# Altium schematic sheet External_connector_Power.SchDoc
size A2; DocumentNumber: 4; SheetNumber: 4; SheetTotal: 10
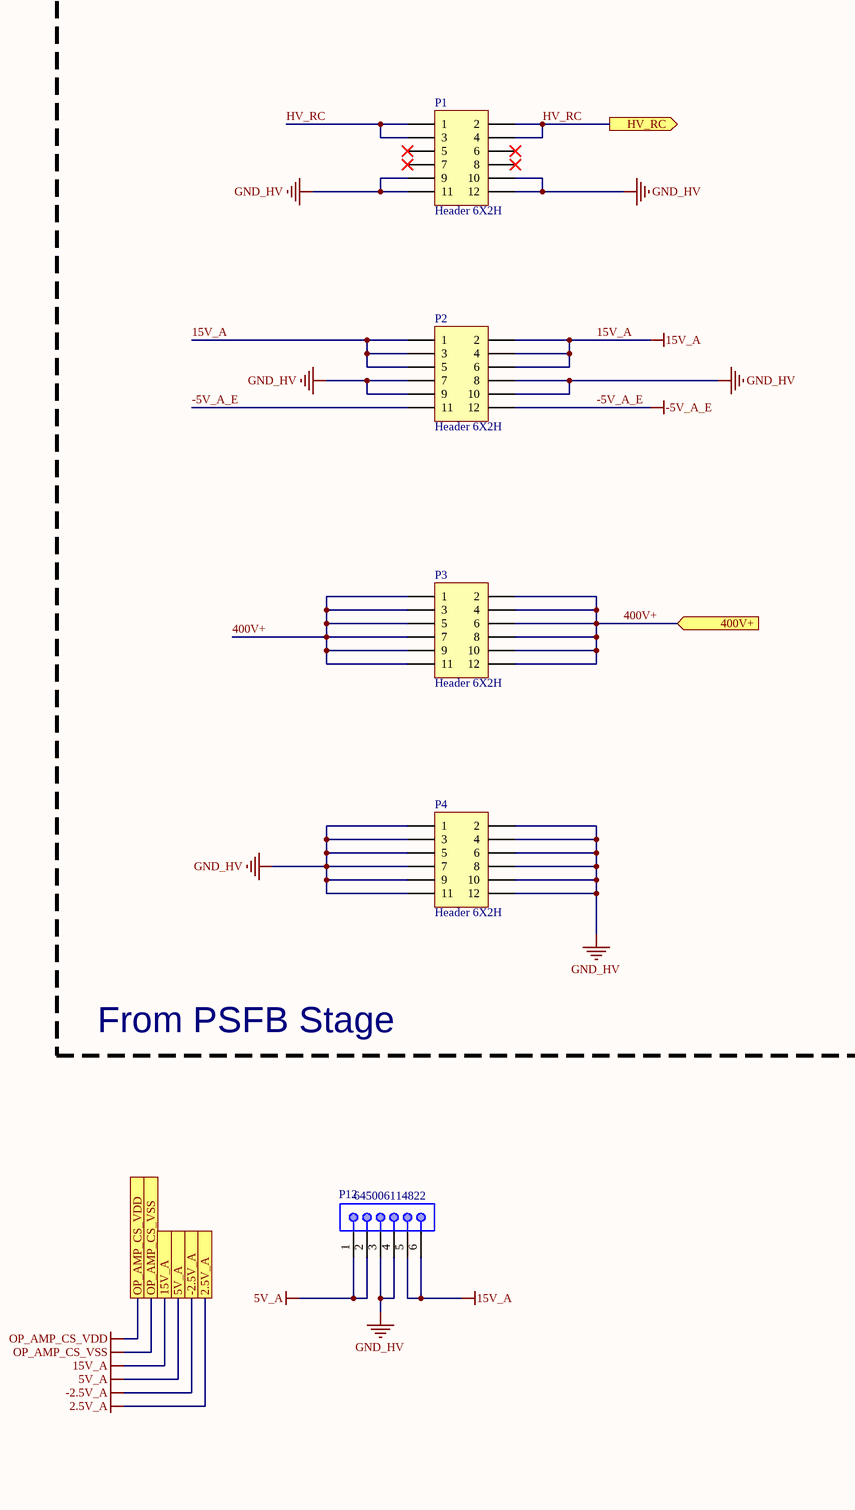
[diagram p0: External_connector_Power.SchDoc, left]
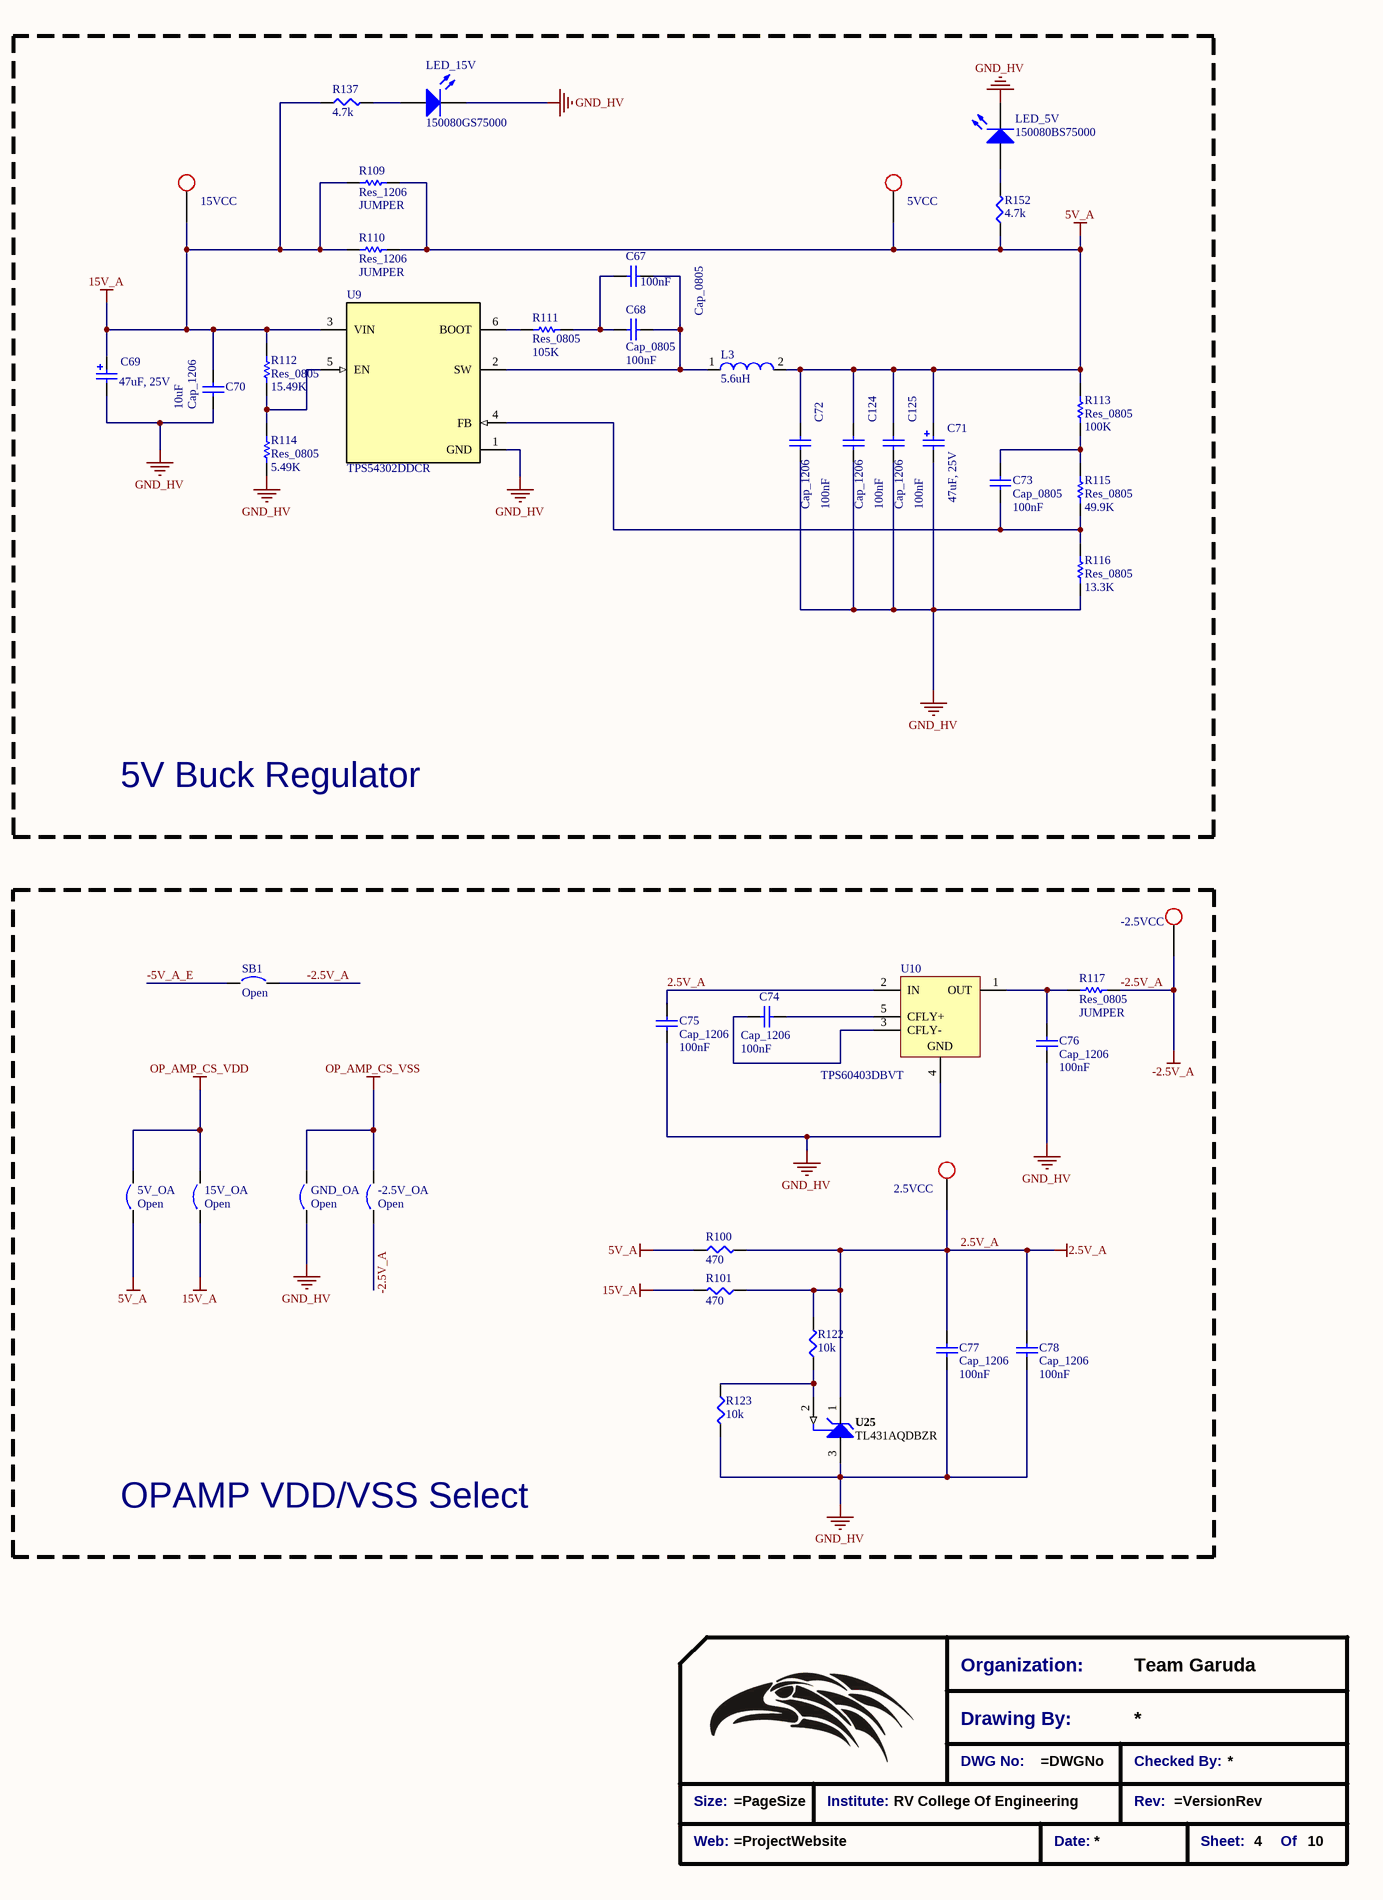
[diagram p1: External_connector_Power.SchDoc, right]

## Parts
2.5VCC  Test Point  [Test_point_SMD]  (value not drawn)  (no BOM)
5V_OA  Open  [Solder Bridge - HP]  (no BOM)
5VCC  Test Point  [Test_point_SMD]  (value not drawn)  (no BOM)
15V_OA  Open  [Solder Bridge - HP]  (no BOM)
15VCC  Test Point  [Test_point_SMD]  (value not drawn)  (no BOM)
*?  Title_Block  (value not drawn)  (graphical)
-2.5V_OA  Open  [Solder Bridge - HP]  (no BOM)
-2.5VCC  Test Point  [Test_point_SMD]  (value not drawn)  (no BOM)
C67  Cap_0805  Size: 100nF  [SMD-0805C]
C68  Cap_0805  Size: 100nF  [SMD-0805C]
C69  47uF, 25V  [WCAP-ASLL_6.3x5.5]
C70  Cap_1206  value 10uF  [SMD-1206C]
C71  47uF, 25V  [WCAP-ASLL_6.3x5.5]
C72  Cap_1206  value 100nF  [SMD-1206C]
C73  Cap_0805  Size: 100nF  [SMD-0805C]
C74  Cap_1206  value 100nF  [SMD-1206C]
C75  Cap_1206  value 100nF  [SMD-1206C]
C76  Cap_1206  value 100nF  [SMD-1206C]
C77  Cap_1206  value 100nF  [SMD-1206C]
C78  Cap_1206  value 100nF  [SMD-1206C]
C124  Cap_1206  value 100nF  [SMD-1206C]
C125  Cap_1206  value 100nF  [SMD-1206C]
GND_OA  Open  [Solder Bridge - HP]  (no BOM)
L3  5.6uH  [WE-PD-L]
LED_5V  150080BS75000  [0805_A]
LED_15V  150080GS75000  [0805_A]
P1  Header 6X2H  [Stackable-20mm]
P2  Header 6X2H  [Stackable-20mm]
P3  Header 6X2H  [Stackable-20mm]
P4  Header 6X2H  [Stackable-20mm]
P12  645006114822  [645006114822]
R100  470  [SMD-1206-RES]
R101  470  [SMD-1206-RES]
R109  Res_1206  value JUMPER  [WRIS-KSKE_1206_H=0.6mm]
R110  Res_1206  value JUMPER  [WRIS-KSKE_1206_H=0.6mm]
R111  Res_0805  value 105K  [WRIS-KSKE_0805_H=0.6mm]
R112  Res_0805  value 15.49K  [WRIS-KSKE_0805_H=0.6mm]
R113  Res_0805  value 100K  [WRIS-KSKE_0805_H=0.6mm]
R114  Res_0805  value 5.49K  [WRIS-KSKE_0805_H=0.6mm]
R115  Res_0805  value 49.9K  [WRIS-KSKE_0805_H=0.6mm]
R116  Res_0805  value 13.3K  [WRIS-KSKE_0805_H=0.6mm]
R117  Res_0805  value JUMPER  [WRIS-KSKE_0805_H=0.6mm]
R122  10k  [SMD-1206-RES]
R123  10k  [SMD-1206-RES]
R137  4.7k  [SMD-0805-RES]
R152  4.7k  [SMD-0805-RES]
SB1  Open  [Solder Bridge - HP - SQ]  (no BOM)
U9  TPS54302DDCR  [SOT95P278X110-6N]
U10  TPS60403DBVT  [DBV0005A_M]
U25  TL431AQDBZR  [DBZ0003A_M]

## Blocks framed on the sheet
From PSFB Stage: P1-P4
5V Buck Regulator: 5VCC 15VCC C67-C73 C124 C125 L3 LED_5V LED_15V R109-R116 R137 R152 U9
OPAMP VDD/VSS Select: 2.5VCC 5V_OA 15V_OA -2.5V_OA -2.5VCC C74-C78 GND_OA R100 R101 R117 R122 R123 SB1 U10 U25

## Ports
2.5V_A, 5V_A, 15V_A, 400V+ (in), -2.5V_A, HV_RC (out), OP_AMP_CS_VDD, OP_AMP_CS_VSS

## Nets
2.5V_A: 2.5VCC.1 C75.2 C77.2 C78.2 R100.2 R101.1 R122.2 U10.2(IN) U25.1(CATHODE) ; port 2.5V_A
5V_A: 5V_OA.1 5VCC.1 C71.2(P) C72.1 C124.1 C125.1 L3.2 P12.1 P12.2 R100.1 R109.2 R110.2 R113.2 R152.1 ; port 5V_A
15V_A: 15V_OA.1 15VCC.1 C69.2(P) C70.1 P2.1 P2.2 P2.3 P2.4 P2.5 P2.6 P12.5 P12.6 R101.2 R109.1 R110.1 R112.2 R137.1 U9.3(VIN) ; port 15V_A
-2.5V_A: -2.5V_OA.1 -2.5VCC.1 R117.2 SB1.2 ; port -2.5V_A
-5V_A_E: P2.11 P2.12 SB1.1
GND_HV: C69.1(N) C70.2 C71.1(N) C72.2 C75.1 C76.1 C77.1 C78.1 C124.2 C125.2 GND_OA.1 LED_5V.1(K) LED_15V.1(K) P1.9 P1.10 P1.11 P1.12 P2.7 P2.8 P2.9 P2.10 P4.1 P4.2 P4.3 P4.4 P4.5 P4.6 P4.7 P4.8 P4.9 P4.10 P4.11 P4.12 P12.3 P12.4 R114.1 R116.1 R123.2 U9.1(GND) U10.4(GND) U25.3(ANODE)
OP_AMP_CS_VDD: 5V_OA.2 15V_OA.2 ; port OP_AMP_CS_VDD
OP_AMP_CS_VSS: -2.5V_OA.2 GND_OA.2 ; port OP_AMP_CS_VSS
400V+: P3.1 P3.2 P3.3 P3.4 P3.5 P3.6 P3.7 P3.8 P3.9 P3.10 P3.11 P3.12 ; port 400V+
HV_RC: P1.1 P1.2 P1.3 P1.4 ; port HV_RC
NetC67_1: C67.1 C68.1 R111.1
NetC67_2: C67.2 C68.2 L3.1 U9.2(SW)
NetC73_1: C73.1 R115.1 R116.2 U9.4(FB)
NetC73_2: C73.2 R113.1 R115.2
NetC74_1: C74.1 U10.5(CFLY+)
NetC74_2: C74.2 U10.3(CFLY-)
NetC76_2: C76.2 R117.1 U10.1(OUT)
NetLED_5V_2: LED_5V.2(A) R152.2
NetLED_15V_2: LED_15V.2(A) R137.2
NetR111_2: R111.2 U9.6(BOOT)
NetR112_1: R112.1 R114.2 U9.5(EN)
NetR122_1: R122.1 R123.1 U25.2(REF)

Not connected (* = marked no-connect by the designer): P1 5* 6* 7* 8*

## Notes on the sheet
- (in symbol Title_Block) Organization:; Team Garuda; Drawing By:; DWG No:; Checked By:; Size:; Institute:; RV College Of Engineering; Rev:; Web:; Date:; Sheet:; Of

## Library data of the parts
2.5VCC 5VCC 15VCC -2.5VCC = Test Point: TP
5V_OA 15V_OA -2.5V_OA GND_OA SB1 = Solder Bridge: Circuit Breaker; Published: 24-Mar-1999; Revision: July-2002: Re-released for DXP Platform.; Publisher: Altium Limited
*? = Title_Block: Standard Title Block
C67 C68 C73 = Cap: Capacitor; Value: 100pF; Published: 8-Jun-2000; LatestRevisionDate: 17-Jul-2002; LatestRevisionNote: Re-released for DXP Platform.; PackageReference: RAD-0.3; Publisher: Altium Limited; PackageDescription: Radial Cap, Thru-Hole; 2 Leads; 0.3 in Pin Spacing
C69 C71 = 865060443004: WCAP-ASLL SMT Aluminum Electrolytic Capacitors, D6.3mm x L5.5mm, 47uF, +/-20%, 25VDC; Dissipation Factor: 14%; Endurance: 2000h; Leakage Current: 11.75uA; Ripple Current max.: 230mA; Technical Reference: ASED055470M025DVCTBB000; ComponentLink1Description: Manufacturer; ComponentLink1URL: http://www.we-online.de; ComponentLink2Description: Datasheet; ComponentLink2URL: https://katalog.we-online.com/pbs/datasheet/865060443004.pdf; Length: 5.5mm; Mounting Technology: SMT; Operating Temperature: -55 to +105degC; Packaging: Tape and Reel; Published Date: August 2019; Capacitance: 47uF; Diameter: 6.3mm; Part Number: 865060443004; Publisher: Wurth Elektronik; Capacitance Tolerance: +/-20%; Rated Voltage: 25VDC
C70 C72 C74-C78 C124 C125 = Cap: Capacitor; Published: 8-Jun-2000; LatestRevisionDate: 17-Jul-2002; LatestRevisionNote: Re-released for DXP Platform.; PackageReference: RAD-0.3; Publisher: Altium Limited; PackageDescription: Radial Cap, Thru-Hole; 2 Leads; 0.3 in Pin Spacing
L3 = CMP-0227-00698-1: SMD-Shielded Power Inductor WE-PD, L = 4.70 µH; Inductance: 4.70 ÂµH; ComponentLink1Description: Manufacturer Link; ComponentLink2Description: Datasheet; ComponentLink2URL: http://www.we-online.de/katalog/media/pdf/744771004.pdf; PackageReference: WE-PD-L; ComponentLink1URL: http://www.we-online.com; DatasheetVersion: ver 7, Sep-2006; PackageDescription: SMD Inductor, 2-Leads, Body 12.0 x 12.0 mm; PackageVersion: 2006
LED_5V = 150080BS75000: SMD mono-color Chip LED, WL-SMCW, Blue; PackageReference: 0805_A; Color: Blue; PartNumber: 150080BS75000; ComponentLink1Description: Manufacturer URL; ComponentLink1URL: http://www.we-online.com; ComponentLink2Description: Datasheet; ComponentLink2URL: http://katalog.we-online.com/led/datasheet/150080BS75000.pdf
LED_15V = 150080GS75000: SMD mono-color Chip LED, WL-SMCW, Green; PackageReference: 0805_A; Color: Green; PartNumber: 150080GS75000; ComponentLink1Description: Manufacturer URL; ComponentLink1URL: http://www.we-online.com; ComponentLink2Description: Datasheet; ComponentLink2URL: http://katalog.we-online.com/led/datasheet/150080GS75000.pdf
P1-P4 = Header 6X2H: Header, 6-Pin, Dual row, Right Angle; LatestRevisionDate: 17-Jul-2002; LatestRevisionNote: Re-released for DXP Platform.; Publisher: Altium Limited
P12 = 645006114822: WR-WTB THT Male Vertical Locking Header, pitch 3.96mm, 6p; Pin Number: 6; Contact Resistance: 20mOhm; Rated Current: 7A; Withstanding Voltage: 1500VAC; Working Voltage: 250VAC; ComponentLink1Description: Manufacturer; ComponentLink1URL: http://www.we-online.de; ComponentLink2Description: Datasheet; ComponentLink2URL: https://www.we-online.com/catalog/datasheet/645006114822.pdf; Pitch: 3.96mm; Published Date: January 2020; Publisher: Wurth Elektronik; Mounting Technology: THT; Packaging: Bag; Operating Temperature: -40 to +105degC; Part Number: 645006114822; Gender: Male; Type: Vertical
R100 R101 = ERJ-8ENF4700V: RES SMD 470 OHM 1% 1/4W 1206; Manufacturer: Panasonic Electronic Components; Factory Stock: 0; Unit Price (USD): 0.00933; @ qty: 1500; Minimum Quantity: 1; Power (Watts): 0.25W, 1/4W; Temperature Coefficient: ±100ppm/°C; Part Number: ERJ-8ENF4700V; Datasheets: http://industrial.panasonic.com/www-cgi/jvcr13pz.cgi?E+PZ+3+AOA0002+ERJ8ENF4700V+7+WW; Image: //media.digikey.com/Renders/Panasonic%20Renders/ERJ-1206%20Pkg.jpg; Digi-Key Part Number: P470FCT-ND; Quantity Available: 55045; Packaging: Cut Tape (CT); Series: ERJ; Part Status: Active; Value: 470; Tolerance: ±1%; Composition: Thick Film; Features: Automotive AEC-Q200; Operating Temperature: -55°C ~ 155°C; Package / Case: 1206 (3216 Metric); Supplier Device Package: 1206; Size / Dimension: 0.126" L x 0.063" W (3.20mm x 1.60mm); Height - Seated (Max): 0.028" (0.70mm); Number of Terminations: 2; Failure Rate: -
R109-R117 = Res1: Resistor; Published: 8-Jun-2000; LatestRevisionDate: 17-Jul-2002; LatestRevisionNote: Re-released for DXP Platform.; PackageReference: AXIAL-0.3; Publisher: Altium Limited; PackageDescription: Axial Device, Thru-Hole; 2 Leads; 0.3 in Pin Spacing
R122 R123 = ERJ-8ENF1002V: RES SMD 10K OHM 1% 1/4W 1206; Manufacturer: Panasonic Electronic Components; Factory Stock: 0; Unit Price (USD): 0.00933; @ qty: 1500; Minimum Quantity: 1; Power (Watts): 0.25W, 1/4W; Temperature Coefficient: ±100ppm/°C; Part Number: ERJ-8ENF1002V; Datasheets: http://industrial.panasonic.com/www-cgi/jvcr13pz.cgi?E+PZ+3+AOA0002+ERJ8ENF1002V+7+WW; Image: //media.digikey.com/Renders/Panasonic%20Renders/ERJ-1206%20Pkg.jpg; Digi-Key Part Number: P10.0KFCT-ND; Quantity Available: 1108398; Packaging: Cut Tape (CT); Series: ERJ; Part Status: Active; Value: 10k; Tolerance: ±1%; Composition: Thick Film; Features: Automotive AEC-Q200; Operating Temperature: -55°C ~ 155°C; Package / Case: 1206 (3216 Metric); Supplier Device Package: 1206; Size / Dimension: 0.126" L x 0.063" W (3.20mm x 1.60mm); Height - Seated (Max): 0.028" (0.70mm); Number of Terminations: 2; Failure Rate: -
R137 R152 = ERJ-6ENF4701V: RES SMD 4.7K OHM 1% 1/8W 0805; Manufacturer: Panasonic Electronic Components; Factory Stock: 0; Unit Price (USD): 0.00729; @ qty: 1500; Minimum Quantity: 1; Power (Watts): 0.125W, 1/8W; Temperature Coefficient: ±100ppm/°C; Part Number: ERJ-6ENF4701V; Datasheets: http://industrial.panasonic.com/www-cgi/jvcr13pz.cgi?E+PZ+3+AOA0002+ERJ6ENF4701V+7+WW; Image: //media.digikey.com/Renders/Panasonic%20Renders/ERJ-0805%20Pkg.jpg; Digi-Key Part Number: P4.70KCCT-ND; Quantity Available: 312387; Packaging: Cut Tape (CT); Series: ERJ; Part Status: Active; Value: 4.7k; Tolerance: ±1%; Composition: Thick Film; Features: Automotive AEC-Q200; Operating Temperature: -55°C ~ 155°C; Package / Case: 0805 (2012 Metric); Supplier Device Package: 0805; Size / Dimension: 0.079" L x 0.049" W (2.00mm x 1.25mm); Height - Seated (Max): 0.028" (0.70mm); Number of Terminations: 2; Failure Rate: -
U9 = TPS54302DDCR: Imported; Manufacturer: Texas Instruments; PartNumber: TPS54302DDC; RefDes: RefDes; TYPE: TYPE; Value: Value; Manufacturer_Part_Number: TPS54302DDCR; Manufacturer_Name: Texas Instruments
U10 = CMP-0391-00003-2: -1.8 to -5.25 V, Inverting Charge Pump Regulator, 60 mA, 1.8 to 5.25 V Input with 2-Cell Alkaline / Nixx Input, -40 to 85 degC, 5-pin SOT23 (DBV5), Green (RoHS & no Sb/Br); Manufacturer: Texas Instruments; Topology: Inverting Buck/Boost; Switching Frequency(Max)(kHz): 300; Efficiency(Typ)(%): 99; Iout(Max)(A): 0.06; 2-Cell Alkaline/Nixx Input: TRUE; Iq(Typ)(mA): 0.425; Vin(Min)(V): 1.8; Vin(Max)(V): 5.25; Vout(Max)(V): -5.25; PartNumber: TPS60403DBVT; Eco-Plan: Green (RoHS & no Sb/Br); ComponentLink3URL: http://www.ti.com/litv/pdf/mpds018i; DatasheetVersion: SLVS324A; PackageReference: DBV0005A; ComponentLink2URL: http://www.ti.com/general/docs/lit/getliterature.tsp?genericPartNumber=TPS60403&fileType=pdf; PackageVersion: 4073253-4/K; ComponentLink1URL: http://www.ti.com/; Vout(Min)(V): -1.8; ComponentLink2Description: Datasheet; Mounting Technology: Surface Mount; ComponentLink3Description: Package Specification; ComponentLink1Description: Manufacturer URL; Code_JEDEC: MO-178; PackageDescription: 5-Pin Plastic Small Outline, Body 1.60 Ãƒâ€” 2.90 mm, Pitch 0.95 mm
U25 = CMP-0366-01210-2: Adjustable Precision Shunt Regulator, 34 ppm / degC, 100 mA, -40 to 125 degC, 3-pin SOT-23 (DBZ), Green (RoHS & no Sb/Br); Manufacturer: Texas Instruments; Iout/Iz(Max)(mA): 100; Min Iz for Regulation(uA): 600; SubFamily: Shunt Voltage Reference; Temp Coeff(Typ)(ppm/ degree C): 34; VO Adj(Max)(V): 36; Rating: Catalog; Initial Accuracy @ 25/deg C(%): 1; VO Adj(Min)(V): 2.495; Temp Coeff(Max)(ppm/ degree C): 92; PackageReference: DBZ0003A; ComponentLink1Description: Manufacturer URL; Mounting Technology: Surface Mount; ComponentLink2URL: http://www.ti.com/general/docs/lit/getliterature.tsp?genericPartNumber=TL431A&fileType=pdf; PackageVersion: 4203227/B; ComponentLink2Description: Datasheet; PackageDescription: 3-Pin Plastic Small Outline, Body 2.92 x 1.3 mm, Pitch 0.95 mm; ComponentLink1URL: http://www.ti.com/; Eco-Plan: Green (RoHS & no Sb/Br); Code_JEDEC: TO-236; ComponentLink3URL: http://www.ti.com/litv/pdf/mpds108a; DatasheetVersion: SLVS543M; ComponentLink3Description: Package Specification; PartNumber: TL431AQDBZR